# Altium schematic sheet SW.SchDoc
size D
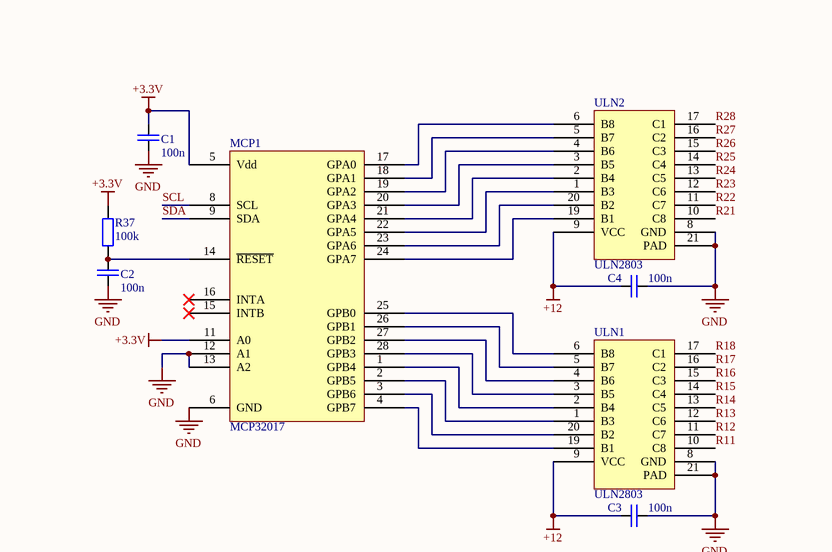
[diagram p0: SW.SchDoc, top left]
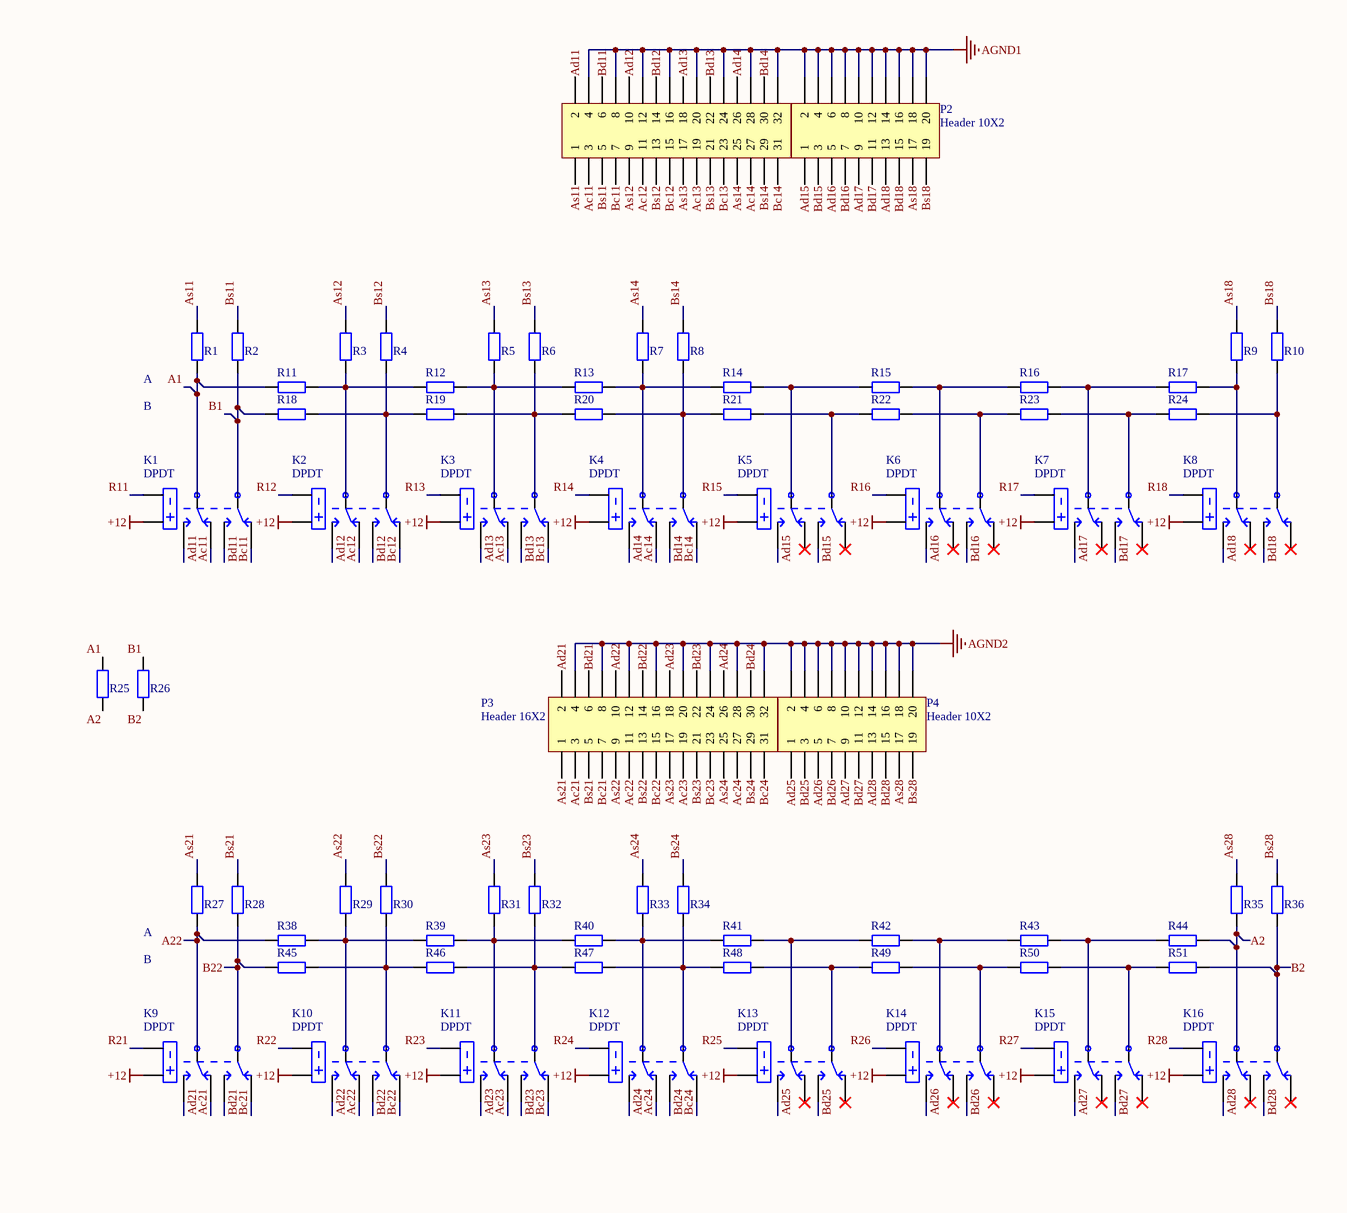
[diagram p1: SW.SchDoc, top right]
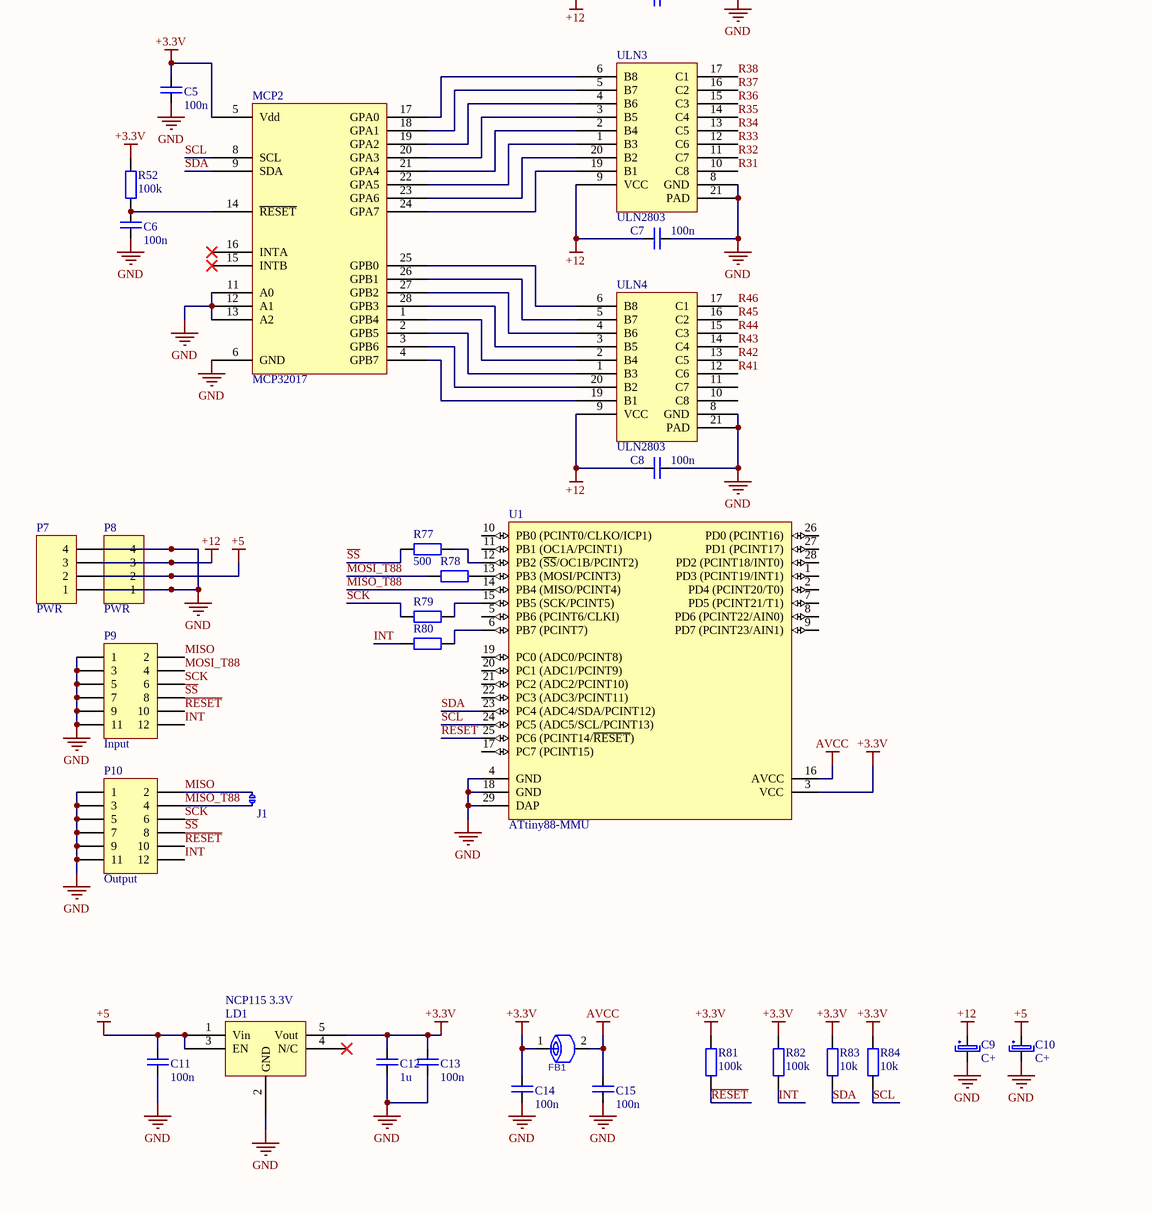
[diagram p2: SW.SchDoc, bottom left]
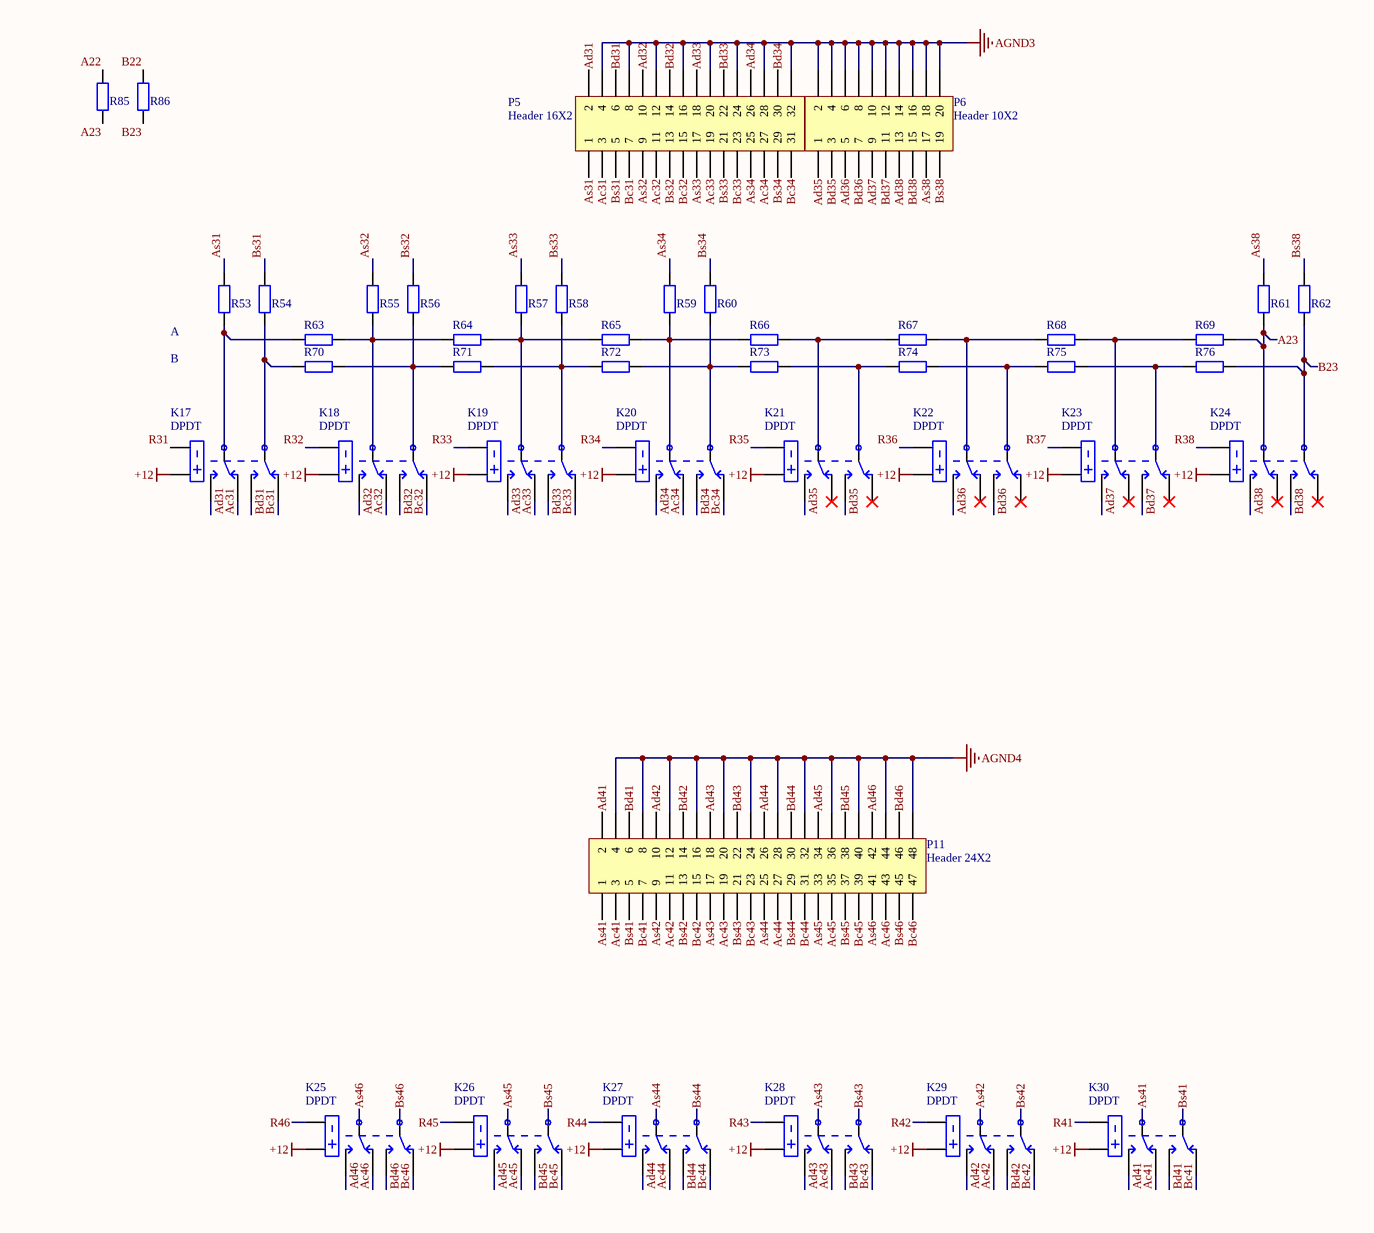
[diagram p3: SW.SchDoc, bottom right]

## Parts
C1  100n  [R1005_0402i_L]
C2  100n  [R1005_0402i_L]
C3  100n  [R1005_0402i_L]
C4  100n  [R1005_0402i_L]
C5  100n  [R1005_0402i_L]
C6  100n  [R1005_0402i_L]
C7  100n  [R1005_0402i_L]
C8  100n  [R1005_0402i_L]
C9  C+  [C AlElko 5x11 R2]
C10  C+  [C AlElko 5x11 R2]
C11  100n  [R1005_0402i_L]
C12  1u  [C1608_0603I_L]
C13  100n  [R1005_0402i_L]
C14  100n  [R1005_0402i_L]
C15  100n  [R1005_0402i_L]
FB1  FERITTE BEAD  [R1608_0603I_L]  (value not drawn)
J1  Terminator  [solderJumper]  (value not drawn)
K1  DPDT  [AXICOM IM-G Relay]
K2  DPDT  [AXICOM IM-G Relay]
K3  DPDT  [AXICOM IM-G Relay]
K4  DPDT  [AXICOM IM-G Relay]
K5  DPDT  [AXICOM IM-G Relay]
K6  DPDT  [AXICOM IM-G Relay]
K7  DPDT  [AXICOM IM-G Relay]
K8  DPDT  [AXICOM IM-G Relay]
K9  DPDT  [AXICOM IM-G Relay]
K10  DPDT  [AXICOM IM-G Relay]
K11  DPDT  [AXICOM IM-G Relay]
K12  DPDT  [AXICOM IM-G Relay]
K13  DPDT  [AXICOM IM-G Relay]
K14  DPDT  [AXICOM IM-G Relay]
K15  DPDT  [AXICOM IM-G Relay]
K16  DPDT  [AXICOM IM-G Relay]
K17  DPDT  [AXICOM IM-G Relay]
K18  DPDT  [AXICOM IM-G Relay]
K19  DPDT  [AXICOM IM-G Relay]
K20  DPDT  [AXICOM IM-G Relay]
K21  DPDT  [AXICOM IM-G Relay]
K22  DPDT  [AXICOM IM-G Relay]
K23  DPDT  [AXICOM IM-G Relay]
K24  DPDT  [AXICOM IM-G Relay]
K25  DPDT  [AXICOM IM-G Relay]
K26  DPDT  [AXICOM IM-G Relay]
K27  DPDT  [AXICOM IM-G Relay]
K28  DPDT  [AXICOM IM-G Relay]
K29  DPDT  [AXICOM IM-G Relay]
K30  DPDT  [AXICOM IM-G Relay]
LD1  NCP115 3.3V  [TSOP95P280X110-6L]
MCP1  MCP32017  [MCP23017 QFN]
MCP2  MCP32017  [MCP23017 QFN]
P1  Header 16X2  [HDR2X16]
P2  Header 10X2  [HDR2X10]
P3  Header 16X2  [HDR2X16]
P4  Header 10X2  [HDR2X10]
P5  Header 16X2  [HDR2X16]
P6  Header 10X2  [HDR2X10]
P7  PWR  [HDR1X4]
P8  PWR  [HDR1X4]
P9  Input  [1.27mm SMD conn]
P10  Output  [1.27mm SMD conn]
P11  Header 24X2  [HDR2X24]
R1  R  [R1608_0603I_L]  (value not drawn)
R2  R  [R1608_0603I_L]  (value not drawn)
R3  R  [R1608_0603I_L]  (value not drawn)
R4  R  [R1608_0603I_L]  (value not drawn)
R5  R  [R1608_0603I_L]  (value not drawn)
R6  R  [R1608_0603I_L]  (value not drawn)
R7  R  [R1608_0603I_L]  (value not drawn)
R8  R  [R1608_0603I_L]  (value not drawn)
R9  R  [R1608_0603I_L]  (value not drawn)
R10  R  [R1608_0603I_L]  (value not drawn)
R11  R  [R1608_0603I_L]  (value not drawn)
R12  R  [R1608_0603I_L]  (value not drawn)
R13  R  [R1608_0603I_L]  (value not drawn)
R14  R  [R1608_0603I_L]  (value not drawn)
R15  R  [R1608_0603I_L]  (value not drawn)
R16  R  [R1608_0603I_L]  (value not drawn)
R17  R  [R1608_0603I_L]  (value not drawn)
R18  R  [R1608_0603I_L]  (value not drawn)
R19  R  [R1608_0603I_L]  (value not drawn)
R20  R  [R1608_0603I_L]  (value not drawn)
R21  R  [R1608_0603I_L]  (value not drawn)
R22  R  [R1608_0603I_L]  (value not drawn)
R23  R  [R1608_0603I_L]  (value not drawn)
R24  R  [R1608_0603I_L]  (value not drawn)
R25  R  [R1608_0603I_L]  (value not drawn)
R26  R  [R1608_0603I_L]  (value not drawn)
R27  R  [R1608_0603I_L]  (value not drawn)
R28  R  [R1608_0603I_L]  (value not drawn)
R29  R  [R1608_0603I_L]  (value not drawn)
R30  R  [R1608_0603I_L]  (value not drawn)
R31  R  [R1608_0603I_L]  (value not drawn)
R32  R  [R1608_0603I_L]  (value not drawn)
R33  R  [R1608_0603I_L]  (value not drawn)
R34  R  [R1608_0603I_L]  (value not drawn)
R35  R  [R1608_0603I_L]  (value not drawn)
R36  R  [R1608_0603I_L]  (value not drawn)
R37  100k  [R1005_0402i_L]
R38  R  [R1608_0603I_L]  (value not drawn)
R39  R  [R1608_0603I_L]  (value not drawn)
R40  R  [R1608_0603I_L]  (value not drawn)
R41  R  [R1608_0603I_L]  (value not drawn)
R42  R  [R1608_0603I_L]  (value not drawn)
R43  R  [R1608_0603I_L]  (value not drawn)
R44  R  [R1608_0603I_L]  (value not drawn)
R45  R  [R1608_0603I_L]  (value not drawn)
R46  R  [R1608_0603I_L]  (value not drawn)
R47  R  [R1608_0603I_L]  (value not drawn)
R48  R  [R1608_0603I_L]  (value not drawn)
R49  R  [R1608_0603I_L]  (value not drawn)
R50  R  [R1608_0603I_L]  (value not drawn)
R51  R  [R1608_0603I_L]  (value not drawn)
R52  100k  [R1005_0402i_L]
R53  R  [R1608_0603I_L]  (value not drawn)
R54  R  [R1608_0603I_L]  (value not drawn)
R55  R  [R1608_0603I_L]  (value not drawn)
R56  R  [R1608_0603I_L]  (value not drawn)
R57  R  [R1608_0603I_L]  (value not drawn)
R58  R  [R1608_0603I_L]  (value not drawn)
R59  R  [R1608_0603I_L]  (value not drawn)
R60  R  [R1608_0603I_L]  (value not drawn)
R61  R  [R1608_0603I_L]  (value not drawn)
R62  R  [R1608_0603I_L]  (value not drawn)
R63  R  [R1608_0603I_L]  (value not drawn)
R64  R  [R1608_0603I_L]  (value not drawn)
R65  R  [R1608_0603I_L]  (value not drawn)
R66  R  [R1608_0603I_L]  (value not drawn)
R67  R  [R1608_0603I_L]  (value not drawn)
R68  R  [R1608_0603I_L]  (value not drawn)
R69  R  [R1608_0603I_L]  (value not drawn)
R70  R  [R1608_0603I_L]  (value not drawn)
R71  R  [R1608_0603I_L]  (value not drawn)
R72  R  [R1608_0603I_L]  (value not drawn)
R73  R  [R1608_0603I_L]  (value not drawn)
R74  R  [R1608_0603I_L]  (value not drawn)
R75  R  [R1608_0603I_L]  (value not drawn)
R76  R  [R1608_0603I_L]  (value not drawn)
R77  500  [R1005_0402i_L]
R78  500  [R1005_0402i_L]  (value not drawn)
R79  500  [R1005_0402i_L]  (value not drawn)
R80  500  [R1005_0402i_L]  (value not drawn)
R81  100k  [R1005_0402i_L]
R82  100k  [R1005_0402i_L]
R83  10k  [R1005_0402i_L]
R84  10k  [R1005_0402i_L]
R85  R  [R1608_0603I_L]  (value not drawn)
R86  R  [R1608_0603I_L]  (value not drawn)
U1  ATtiny88-MMU  [28M1_N]
ULN1  ULN2803  [QFN127P600-8N]
ULN2  ULN2803  [QFN127P600-8N]
ULN3  ULN2803  [QFN127P600-8N]
ULN4  ULN2803  [QFN127P600-8N]

## Nets
+3.3V: C1.2 C5.2 C12.1 C13.1 C14.1 FB1.1 LD1.5(Vout) MCP1.5(Vdd) MCP1.11(A0) MCP2.5(Vdd) R37.1 R52.1 R81.1 R82.1 R83.1 R84.1 U1.3(VCC)
+5: C10.1 C11.1 LD1.1(Vin) LD1.3(EN) P7.2 P8.2
+12: C3.1 C4.1 C7.1 C8.1 C9.1 K1.1 K2.1 K3.1 K4.1 K5.1 K6.1 K7.1 K8.1 K9.1 K10.1 K11.1 K12.1 K13.1 K14.1 K15.1 K16.1 K17.1 K18.1 K19.1 K20.1 K21.1 K22.1 K23.1 K24.1 K25.1 K26.1 K27.1 K28.1 K29.1 K30.1 P7.3 P8.3 ULN1.9(VCC) ULN2.9(VCC) ULN3.9(VCC) ULN4.9(VCC)
AGND1: P1.4 P1.8 P1.12 P1.16 P1.20 P1.24 P1.28 P1.32 P2.2 P2.4 P2.6 P2.8 P2.10 P2.12 P2.14 P2.16 P2.18 P2.20
AGND2: P3.4 P3.8 P3.12 P3.16 P3.20 P3.24 P3.28 P3.32 P4.2 P4.4 P4.6 P4.8 P4.10 P4.12 P4.14 P4.16 P4.18 P4.20
AGND3: P5.4 P5.8 P5.12 P5.16 P5.20 P5.24 P5.28 P5.32 P6.2 P6.4 P6.6 P6.8 P6.10 P6.12 P6.14 P6.16 P6.18 P6.20
AGND4: P11.4 P11.8 P11.12 P11.16 P11.20 P11.24 P11.28 P11.32 P11.36 P11.40 P11.44 P11.48
AVCC: C15.1 FB1.2 U1.16(AVCC)
GND: C1.1 C2.1 C3.2 C4.2 C5.1 C6.1 C7.2 C8.2 C9.2 C10.2 C11.2 C12.2 C13.2 C14.2 C15.2 LD1.2(GND) MCP1.6(GND) MCP1.12(A1) MCP1.13(A2) MCP2.6(GND) MCP2.11(A0) MCP2.12(A1) MCP2.13(A2) P7.1 P7.4 P8.1 P8.4 P9.1 P9.3 P9.5 P9.7 P9.9 P9.11 P10.1 P10.3 P10.5 P10.7 P10.9 P10.11 U1.4(GND) U1.18(GND) U1.29(DAP) ULN1.8(GND) ULN1.21(PAD) ULN2.8(GND) ULN2.21(PAD) ULN3.8(GND) ULN3.21(PAD) ULN4.8(GND) ULN4.21(PAD)
A1: K1.3 R1.1 R11.1 R25.2
A2: K16.3 R25.1 R35.1 R44.2
A22: K9.3 R27.1 R38.1 R85.2
A23: K24.3 R61.1 R69.2 R85.1
Ac11: K1.2 P1.3
Ac12: K2.2 P1.11
Ac13: K3.2 P1.19
Ac14: K4.2 P1.27
Ac21: K9.2 P3.3
Ac22: K10.2 P3.11
Ac23: K11.2 P3.19
Ac24: K12.2 P3.27
Ac31: K17.2 P5.3
Ac32: K18.2 P5.11
Ac33: K19.2 P5.19
Ac34: K20.2 P5.27
Ac41: K30.2 P11.3
Ac42: K29.2 P11.11
Ac43: K28.2 P11.19
Ac44: K27.2 P11.27
Ac45: K26.2 P11.35
Ac46: K25.2 P11.43
Ad11: K1.4 P1.2
Ad12: K2.4 P1.10
Ad13: K3.4 P1.18
Ad14: K4.4 P1.26
Ad15: K5.4 P2.1
Ad16: K6.4 P2.5
Ad17: K7.4 P2.9
Ad18: K8.4 P2.13
Ad21: K9.4 P3.2
Ad22: K10.4 P3.10
Ad23: K11.4 P3.18
Ad24: K12.4 P3.26
Ad25: K13.4 P4.1
Ad26: K14.4 P4.5
Ad27: K15.4 P4.9
Ad28: K16.4 P4.13
Ad31: K17.4 P5.2
Ad32: K18.4 P5.10
Ad33: K19.4 P5.18
Ad34: K20.4 P5.26
Ad35: K21.4 P6.1
Ad36: K22.4 P6.5
Ad37: K23.4 P6.9
Ad38: K24.4 P6.13
Ad41: K30.4 P11.2
Ad42: K29.4 P11.10
Ad43: K28.4 P11.18
Ad44: K27.4 P11.26
Ad45: K26.4 P11.34
Ad46: K25.4 P11.42
As11: P1.1 R1.2
As12: P1.9 R3.2
As13: P1.17 R5.2
As14: P1.25 R7.2
As18: P2.17 R9.2
As21: P3.1 R27.2
As22: P3.9 R29.2
As23: P3.17 R31.2
As24: P3.25 R33.2
As28: P4.17 R35.2
As31: P5.1 R53.2
As32: P5.9 R55.2
As33: P5.17 R57.2
As34: P5.25 R59.2
As38: P6.17 R61.2
As41: K30.3 P11.1
As42: K29.3 P11.9
As43: K28.3 P11.17
As44: K27.3 P11.25
As45: K26.3 P11.33
As46: K25.3 P11.41
B1: K1.6 R2.1 R18.1 R26.2
B2: K16.6 R26.1 R36.1 R51.2
B22: K9.6 R28.1 R45.1 R86.2
B23: K24.6 R62.1 R76.2 R86.1
Bc11: K1.7 P1.7
Bc12: K2.7 P1.15
Bc13: K3.7 P1.23
Bc14: K4.7 P1.31
Bc21: K9.7 P3.7
Bc22: K10.7 P3.15
Bc23: K11.7 P3.23
Bc24: K12.7 P3.31
Bc31: K17.7 P5.7
Bc32: K18.7 P5.15
Bc33: K19.7 P5.23
Bc34: K20.7 P5.31
Bc41: K30.7 P11.7
Bc42: K29.7 P11.15
Bc43: K28.7 P11.23
Bc44: K27.7 P11.31
Bc45: K26.7 P11.39
Bc46: K25.7 P11.47
Bd11: K1.5 P1.6
Bd12: K2.5 P1.14
Bd13: K3.5 P1.22
Bd14: K4.5 P1.30
Bd15: K5.5 P2.3
Bd16: K6.5 P2.7
Bd17: K7.5 P2.11
Bd18: K8.5 P2.15
Bd21: K9.5 P3.6
Bd22: K10.5 P3.14
Bd23: K11.5 P3.22
Bd24: K12.5 P3.30
Bd25: K13.5 P4.3
Bd26: K14.5 P4.7
Bd27: K15.5 P4.11
Bd28: K16.5 P4.15
Bd31: K17.5 P5.6
Bd32: K18.5 P5.14
Bd33: K19.5 P5.22
Bd34: K20.5 P5.30
Bd35: K21.5 P6.3
Bd36: K22.5 P6.7
Bd37: K23.5 P6.11
Bd38: K24.5 P6.15
Bd41: K30.5 P11.6
Bd42: K29.5 P11.14
Bd43: K28.5 P11.22
Bd44: K27.5 P11.30
Bd45: K26.5 P11.38
Bd46: K25.5 P11.46
Bs11: P1.5 R2.2
Bs12: P1.13 R4.2
Bs13: P1.21 R6.2
Bs14: P1.29 R8.2
Bs18: P2.19 R10.2
Bs21: P3.5 R28.2
Bs22: P3.13 R30.2
Bs23: P3.21 R32.2
Bs24: P3.29 R34.2
Bs28: P4.19 R36.2
Bs31: P5.5 R54.2
Bs32: P5.13 R56.2
Bs33: P5.21 R58.2
Bs34: P5.29 R60.2
Bs38: P6.19 R62.2
Bs41: K30.6 P11.5
Bs42: K29.6 P11.13
Bs43: K28.6 P11.21
Bs44: K27.6 P11.29
Bs45: K26.6 P11.37
Bs46: K25.6 P11.45
INT: P9.12 P10.12 R80.1 R82.2
MISO: J1.2 P9.2 P10.2
MISO_T88: J1.1 P10.4 U1.14(PB4_(MISO/PCINT4))
MOSI_T88: P9.4 R78.1
R11: K1.8 ULN1.10(C8)
R12: K2.8 ULN1.11(C7)
R13: K3.8 ULN1.12(C6)
R14: K4.8 ULN1.13(C5)
R15: K5.8 ULN1.14(C4)
R16: K6.8 ULN1.15(C3)
R17: K7.8 ULN1.16(C2)
R18: K8.8 ULN1.17(C1)
R21: K9.8 ULN2.10(C8)
R22: K10.8 ULN2.11(C7)
R23: K11.8 ULN2.12(C6)
R24: K12.8 ULN2.13(C5)
R25: K13.8 ULN2.14(C4)
R26: K14.8 ULN2.15(C3)
R27: K15.8 ULN2.16(C2)
R28: K16.8 ULN2.17(C1)
R31: K17.8 ULN3.10(C8)
R32: K18.8 ULN3.11(C7)
R33: K19.8 ULN3.12(C6)
R34: K20.8 ULN3.13(C5)
R35: K21.8 ULN3.14(C4)
R36: K22.8 ULN3.15(C3)
R37: K23.8 ULN3.16(C2)
R38: K24.8 ULN3.17(C1)
R41: K30.8 ULN4.12(C6)
R42: K29.8 ULN4.13(C5)
R43: K28.8 ULN4.14(C4)
R44: K27.8 ULN4.15(C3)
R45: K26.8 ULN4.16(C2)
R46: K25.8 ULN4.17(C1)
~{RESET}: P9.10 P10.10 R81.2 U1.25(PC6_(PCINT14/~{RESET}))
~{SS}: P9.8 P10.8 R77.1
SCK: P9.6 P10.6 R79.1
SCL: MCP1.8(SCL) MCP2.8(SCL) R84.2 U1.24(PC5_(ADC5/SCL/PCINT13))
SDA: MCP1.9(SDA) MCP2.9(SDA) R83.2 U1.23(PC4_(ADC4/SDA/PCINT12))
NetC2_2: C2.2 MCP1.14(~{RESET}) R37.2
NetC6_2: C6.2 MCP2.14(~{RESET}) R52.2
NetK2_3: K2.3 R3.1 R11.2 R12.1
NetK2_6: K2.6 R4.1 R18.2 R19.1
NetK3_3: K3.3 R5.1 R12.2 R13.1
NetK3_6: K3.6 R6.1 R19.2 R20.1
NetK4_3: K4.3 R7.1 R13.2 R14.1
NetK4_6: K4.6 R8.1 R20.2 R21.1
NetK5_3: K5.3 R14.2 R15.1
NetK5_6: K5.6 R21.2 R22.1
NetK6_3: K6.3 R15.2 R16.1
NetK6_6: K6.6 R22.2 R23.1
NetK7_3: K7.3 R16.2 R17.1
NetK7_6: K7.6 R23.2 R24.1
NetK8_3: K8.3 R9.1 R17.2
NetK8_6: K8.6 R10.1 R24.2
NetK10_3: K10.3 R29.1 R38.2 R39.1
NetK10_6: K10.6 R30.1 R45.2 R46.1
NetK11_3: K11.3 R31.1 R39.2 R40.1
NetK11_6: K11.6 R32.1 R46.2 R47.1
NetK12_3: K12.3 R33.1 R40.2 R41.1
NetK12_6: K12.6 R34.1 R47.2 R48.1
NetK13_3: K13.3 R41.2 R42.1
NetK13_6: K13.6 R48.2 R49.1
NetK14_3: K14.3 R42.2 R43.1
NetK14_6: K14.6 R49.2 R50.1
NetK15_3: K15.3 R43.2 R44.1
NetK15_6: K15.6 R50.2 R51.1
NetK17_3: K17.3 R53.1 R63.1
NetK17_6: K17.6 R54.1 R70.1
NetK18_3: K18.3 R55.1 R63.2 R64.1
NetK18_6: K18.6 R56.1 R70.2 R71.1
NetK19_3: K19.3 R57.1 R64.2 R65.1
NetK19_6: K19.6 R58.1 R71.2 R72.1
NetK20_3: K20.3 R59.1 R65.2 R66.1
NetK20_6: K20.6 R60.1 R72.2 R73.1
NetK21_3: K21.3 R66.2 R67.1
NetK21_6: K21.6 R73.2 R74.1
NetK22_3: K22.3 R67.2 R68.1
NetK22_6: K22.6 R74.2 R75.1
NetK23_3: K23.3 R68.2 R69.1
NetK23_6: K23.6 R75.2 R76.1
NetMCP1_1: MCP1.1(GPB4) ULN1.2(B4)
NetMCP1_2: MCP1.2(GPB5) ULN1.1(B3)
NetMCP1_3: MCP1.3(GPB6) ULN1.20(B2)
NetMCP1_4: MCP1.4(GPB7) ULN1.19(B1)
NetMCP1_17: MCP1.17(GPA0) ULN2.6(B8)
NetMCP1_18: MCP1.18(GPA1) ULN2.5(B7)
NetMCP1_19: MCP1.19(GPA2) ULN2.4(B6)
NetMCP1_20: MCP1.20(GPA3) ULN2.3(B5)
NetMCP1_21: MCP1.21(GPA4) ULN2.2(B4)
NetMCP1_22: MCP1.22(GPA5) ULN2.1(B3)
NetMCP1_23: MCP1.23(GPA6) ULN2.20(B2)
NetMCP1_24: MCP1.24(GPA7) ULN2.19(B1)
NetMCP1_25: MCP1.25(GPB0) ULN1.6(B8)
NetMCP1_26: MCP1.26(GPB1) ULN1.5(B7)
NetMCP1_27: MCP1.27(GPB2) ULN1.4(B6)
NetMCP1_28: MCP1.28(GPB3) ULN1.3(B5)
NetMCP2_1: MCP2.1(GPB4) ULN4.2(B4)
NetMCP2_2: MCP2.2(GPB5) ULN4.1(B3)
NetMCP2_3: MCP2.3(GPB6) ULN4.20(B2)
NetMCP2_4: MCP2.4(GPB7) ULN4.19(B1)
NetMCP2_17: MCP2.17(GPA0) ULN3.6(B8)
NetMCP2_18: MCP2.18(GPA1) ULN3.5(B7)
NetMCP2_19: MCP2.19(GPA2) ULN3.4(B6)
NetMCP2_20: MCP2.20(GPA3) ULN3.3(B5)
NetMCP2_21: MCP2.21(GPA4) ULN3.2(B4)
NetMCP2_22: MCP2.22(GPA5) ULN3.1(B3)
NetMCP2_23: MCP2.23(GPA6) ULN3.20(B2)
NetMCP2_24: MCP2.24(GPA7) ULN3.19(B1)
NetMCP2_25: MCP2.25(GPB0) ULN4.6(B8)
NetMCP2_26: MCP2.26(GPB1) ULN4.5(B7)
NetMCP2_27: MCP2.27(GPB2) ULN4.4(B6)
NetMCP2_28: MCP2.28(GPB3) ULN4.3(B5)
NetR77_2: R77.2 U1.12(PB2_(~{SS}/OC1B/PCINT2))
NetR78_2: R78.2 U1.13(PB3_(MOSI/PCINT3))
NetR79_2: R79.2 U1.15(PB5_(SCK/PCINT5))
NetR80_2: R80.2 U1.6(PB7_(PCINT7))

Not connected (* = marked no-connect by the designer): K5 2* 7*; K6 2* 7*; K7 2* 7*; K8 2* 7*; K13 2* 7*; K14 2* 7*; K15 2* 7*; K16 2* 7*; K21 2* 7*; K22 2* 7*; K23 2* 7*; K24 2* 7*; LD1 4(N/C)*; MCP1 15(INTB)* 16(INTA)*; MCP2 15(INTB)* 16(INTA)*; U1 1(PD3_(PCINT19/INT1)) 2(PD4_(PCINT20/T0)) 5(PB6_(PCINT6/CLKI)) 7(PD5_(PCINT21/T1)) 8(PD6_(PCINT22/AIN0)) 9(PD7_(PCINT23/AIN1)) 10(PB0_(PCINT0/CLKO/ICP1)) 11(PB1_(OC1A/PCINT1)) 17(PC7_(PCINT15)) 19(PC0_(ADC0/PCINT8)) 20(PC1_(ADC1/PCINT9)) 21(PC2_(ADC2/PCINT10)) 22(PC3_(ADC3/PCINT11)) 26(PD0_(PCINT16)) 27(PD1_(PCINT17)) 28(PD2_(PCINT18/INT0)); ULN4 10(C8) 11(C7)

## Notes on the sheet
- (near R1) A
- B
- (near R27) A
- (near R53) A
- Title
- Size:
- Date:
- File:
- D
- Number:
- Time:
- Revision:
- Sheet
- of

## Library data of the parts
C1-C8 C11-C15 = C: Capacitor
C9 C10 = C+: Capacitor Polarized
J1 = JMP_mini
K1-K30 = IM-GR Relay DPDT: TE CONNECTIVITY  IM-GR  RELAY, DPDT, NO; Farnell ID: 1175070; URL: http://si.farnell.com/te-connectivity-axicom/im06gr/relay-gull-wing-dpco-12vdc-2a/dp/1175070
P1 P3 P5 = Header 16X2: Header, 16-Pin, Dual row; LatestRevisionDate: 17-Jul-2002; LatestRevisionNote: Re-released for DXP Platform.; Publisher: Altium Limited
P2 P4 P6 = Header 10X2: Header, 10-Pin, Dual row; LatestRevisionDate: 17-Jul-2002; LatestRevisionNote: Re-released for DXP Platform.; Publisher: Altium Limited
P7 P8 = Header 4: Header, 4-Pin; LatestRevisionDate: 17-Jul-2002; LatestRevisionNote: Re-released for DXP Platform.; Publisher: Altium Limited
P9 P10 = Header 6X2: Header, 6-Pin, Dual row; LatestRevisionDate: 17-Jul-2002; LatestRevisionNote: Re-released for DXP Platform.; Publisher: Altium Limited
P11 = Header 24X2: Header, 24-Pin, Dual row; LatestRevisionDate: 17-Jul-2002; LatestRevisionNote: Re-released for DXP Platform.; Publisher: Altium Limited
R37 R52 R77-R84 = R
U1 = ATtiny88-MMU: 8-bit AVR Microcontroller, 1.8-5.5V, 8KB Flash, 64 Bytes EEPROM, 512 Bytes SRAM, 28-pin MLF, Industrial Grade (-40°C to 85°C), Pb-Free; Published: 1-Apr-2010; DatasheetVersion: revC, Mar-2009; PackageVersion: revB, Nov-2008; PackageReference: 28M1; Publisher: Altium Limited; PackageDescription: 28-pad, 4x4x1.0mm Body, Pitch 0.45mm, 2.4x2.4mm Exposed Pad, Plastic Very Thin QFN Package (VQFN); Supplier 1: Digi-Key; Supplier Part Number 1: ATTINY88-MMU-ND; Supplier 2: Mouser; Supplier Part Number 2: 556-ATTINY88-MMU; ComponentLink1Description: Manufacturer Link; ComponentLink1URL: http://www.atmel.com/products/avr/default.asp?; ComponentLink2Description: ATtiny48/88 Datasheet; ComponentLink2URL: http://www.atmel.com/dyn/resources/prod_documents/doc8008.pdf; ComponentLink3Description: ATtiny48/88 Summary; ComponentLink3URL: http://www.atmel.com/dyn/resources/prod_documents/8008S.pdf; ComponentLink4Description: Atmel.com Home; ComponentLink4URL: http://www.atmel.com